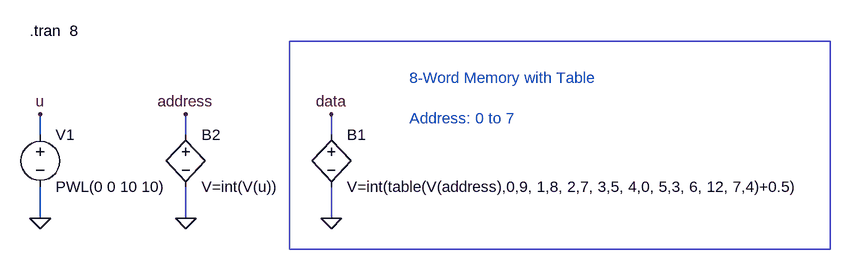
[diagram p0: schematic Memory_8word.asc]
Memory_8word.asc, the LTspice schematic file:
Version 4
SHEET 1 880 680
WIRE -400 224 -400 192
WIRE -176 224 -176 192
WIRE 48 224 48 192
WIRE -400 352 -400 304
WIRE -176 352 -176 304
WIRE 48 352 48 304
FLAG 48 352 0
FLAG 48 192 data
FLAG -400 352 0
FLAG -176 352 0
FLAG -176 192 address
FLAG -400 192 u
SYMBOL bv 48 208 R0
SYMATTR InstName B1
SYMATTR Value V=int(table(V(address),0,9, 1,8, 2,7, 3,5, 4,0, 5,3, 6, 12, 7,4)+0.5)
SYMBOL voltage -400 208 R0
WINDOW 123 0 0 Left 0
WINDOW 39 0 0 Left 0
SYMATTR InstName V1
SYMATTR Value PWL(0 0 10 10)
SYMBOL bv -176 208 R0
SYMATTR InstName B2
SYMATTR Value V=int(V(u))
TEXT -416 64 Left 0 !.tran  8
TEXT 168 136 Left 0 ;8-Word Memory with Table\n \nAddress: 0 to 7
RECTANGLE Normal 816 400 -16 80

The netlist it stands for:
* Memory_8word.asc
B1 data 0 V=int(table(V(address),0,9, 1,8, 2,7, 3,5, 4,0, 5,3, 6, 12, 7,4)+0.5)
V1 u 0 PWL(0 0 10 10)
B2 address 0 V=int(V(u))
.tran  8
* 8-Word Memory with Table
* Address: 0 to 7
.backanno
.end